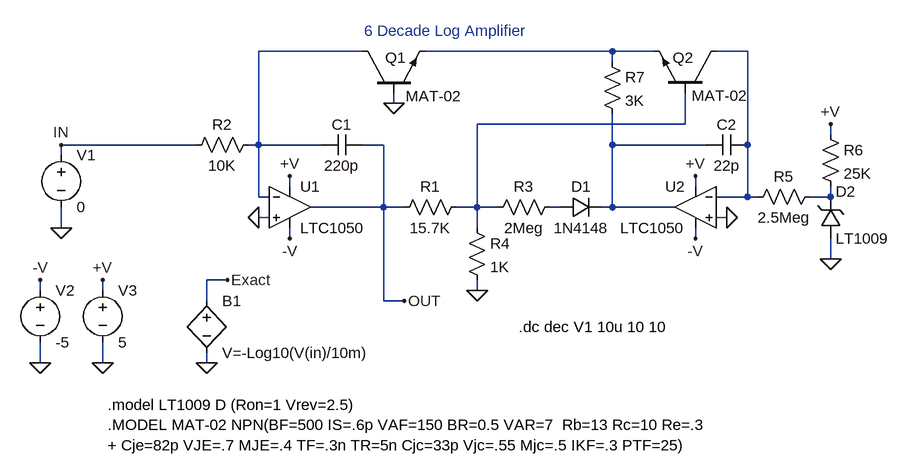
[diagram p0: schematic 1050_6DecadeLogAmplifier.asc]
1050_6DecadeLogAmplifier.asc, the LTspice schematic file:
Version 4
SHEET 1 1616 680
WIRE 240 0 80 0
WIRE 624 0 336 0
WIRE 688 0 624 0
WIRE 832 0 784 0
WIRE 624 16 624 0
WIRE 288 80 288 64
WIRE 736 112 736 64
WIRE 736 112 416 112
WIRE 960 128 960 112
WIRE -16 144 -224 144
WIRE 80 144 80 0
WIRE 80 144 64 144
WIRE 176 144 80 144
WIRE 272 144 240 144
WIRE 624 144 624 96
WIRE 768 144 624 144
WIRE 832 144 832 0
WIRE -224 160 -224 144
WIRE 128 208 128 192
WIRE 752 208 752 192
WIRE 80 224 80 144
WIRE 96 224 80 224
WIRE 832 224 832 144
WIRE 832 224 784 224
WIRE 848 224 832 224
WIRE 960 224 960 208
WIRE 960 224 928 224
WIRE 272 240 272 144
WIRE 272 240 160 240
WIRE 304 240 272 240
WIRE 416 240 416 112
WIRE 416 240 384 240
WIRE 448 240 416 240
WIRE 544 240 528 240
WIRE 624 240 624 144
WIRE 624 240 608 240
WIRE 720 240 624 240
WIRE 96 256 80 256
WIRE 800 256 784 256
WIRE -224 272 -224 240
WIRE 416 272 416 240
WIRE 128 288 128 272
WIRE 752 288 752 272
WIRE 960 320 960 288
WIRE 32 352 0 352
WIRE -256 368 -256 352
WIRE -160 368 -160 352
WIRE 416 368 416 352
WIRE 0 384 0 352
WIRE 272 384 272 240
WIRE 304 384 272 384
WIRE -256 480 -256 448
WIRE -160 480 -160 448
WIRE 0 480 0 464
FLAG -160 480 0
FLAG 128 192 +V
FLAG -160 352 +V
FLAG 128 288 -V
FLAG -256 480 0
FLAG -256 352 -V
FLAG -224 272 0
FLAG 80 256 0
FLAG 288 80 0
FLAG 416 368 0
FLAG 752 192 +V
FLAG 752 288 -V
FLAG 800 256 0
FLAG 960 320 0
FLAG 960 112 +V
FLAG -224 144 IN
FLAG 304 384 OUT
FLAG 0 480 0
FLAG 32 352 Exact
SYMBOL voltage -224 144 R0
SYMATTR InstName V1
SYMATTR Value 0
SYMBOL voltage -256 352 R0
SYMATTR InstName V2
SYMATTR Value -5
SYMBOL res 80 128 R90
WINDOW 0 0 56 VBottom 0
WINDOW 3 32 56 VTop 0
SYMATTR InstName R2
SYMATTR Value 10K
SYMBOL opamps\\LTC1050 128 176 R0
SYMATTR InstName U1
SYMBOL cap 240 128 R90
WINDOW 0 0 32 VBottom 0
WINDOW 3 32 32 VTop 0
SYMATTR InstName C1
SYMATTR Value 220p
SYMBOL npn 240 64 R270
WINDOW 0 39 51 VTop 0
WINDOW 3 -5 66 VRight 0
SYMATTR InstName Q1
SYMATTR Value MAT-02
SYMBOL npn 784 64 M270
WINDOW 0 39 51 VTop 0
WINDOW 3 -4 38 VLeft 0
SYMATTR InstName Q2
SYMATTR Value MAT-02
SYMBOL res 400 224 R90
WINDOW 0 0 56 VBottom 0
WINDOW 3 32 56 VTop 0
SYMATTR InstName R1
SYMATTR Value 15.7K
SYMBOL res 544 224 R90
WINDOW 0 0 56 VBottom 0
WINDOW 3 32 56 VTop 0
SYMATTR InstName R3
SYMATTR Value 2Meg
SYMBOL res 400 256 R0
SYMATTR InstName R4
SYMATTR Value 1K
SYMBOL diode 544 256 R270
WINDOW 0 32 32 VTop 0
WINDOW 3 0 32 VBottom 0
SYMATTR InstName D1
SYMATTR Value 1N4148
SYMBOL opamps\\LTC1050 752 176 M0
SYMATTR InstName U2
SYMBOL cap 832 128 R90
WINDOW 0 0 32 VBottom 0
WINDOW 3 32 32 VTop 0
SYMATTR InstName C2
SYMATTR Value 22p
SYMBOL res 944 208 R90
WINDOW 0 0 56 VBottom 0
WINDOW 3 32 56 VTop 0
SYMATTR InstName R5
SYMATTR Value 2.5Meg
SYMBOL zener 944 288 M180
WINDOW 0 24 72 Left 0
WINDOW 3 24 0 Left 0
SYMATTR InstName D2
SYMATTR Value LT1009
SYMBOL res 944 112 R0
SYMATTR InstName R6
SYMATTR Value 25K
SYMBOL res 608 0 R0
SYMATTR InstName R7
SYMATTR Value 3K
SYMBOL voltage -160 352 R0
SYMATTR InstName V3
SYMATTR Value 5
SYMBOL bv 0 368 R0
SYMATTR InstName B1
SYMATTR Value V=-Log10(V(in)/10m)
TEXT 480 424 Left 0 !.dc dec V1 10u 10 10
TEXT 368 -16 Bottom 0 ;6 Decade Log Amplifier
TEXT -152 544 Left 0 !.model LT1009 D (Ron=1 Vrev=2.5)\n.MODEL MAT-02 NPN(BF=500 IS=.6p VAF=150 BR=0.5 VAR=7  Rb=13 Rc=10 Re=.3\n+ Cje=82p VJE=.7 MJE=.4 TF=.3n TR=5n Cjc=33p Vjc=.55 Mjc=.5 IKF=.3 PTF=25)

The netlist it stands for:
* 1050_6DecadeLogAmplifier.asc
V1 IN 0 0
V2 -V 0 -5
R2 N001 IN 10K
XU1 0 N001 +V -V OUT LTC1050  ; pins In+ In- V+ V- OUT
C1 OUT N001 220p
Q1 N001 0 N002 0 MAT-02
Q2 N003 N004 N002 0 MAT-02
R1 N004 OUT 15.7K
R3 N007 N004 2Meg
R4 N004 0 1K
D1 N007 N005 1N4148
XU2 0 N003 +V -V N005 LTC1050  ; pins In+ In- V+ V- OUT
C2 N003 N005 22p
R5 N006 N003 2.5Meg
D2 0 N006 LT1009
R6 +V N006 25K
R7 N002 N005 3K
V3 +V 0 5
B1 Exact 0 V=-Log10(V(in)/10m)
.model D D
.lib standard.dio
.model NPN NPN
.model PNP PNP
.lib standard.bjt
.dc dec V1 10u 10 10
* 6 Decade Log Amplifier
.model LT1009 D (Ron=1 Vrev=2.5)
.MODEL MAT-02 NPN(BF=500 IS=.6p VAF=150 BR=0.5 VAR=7  Rb=13 Rc=10 Re=.3
+ Cje=82p VJE=.7 MJE=.4 TF=.3n TR=5n Cjc=33p Vjc=.55 Mjc=.5 IKF=.3 PTF=25)
.lib LTC.lib
.backanno
.end